# Altium schematic sheet Ports.SchDoc
size A4
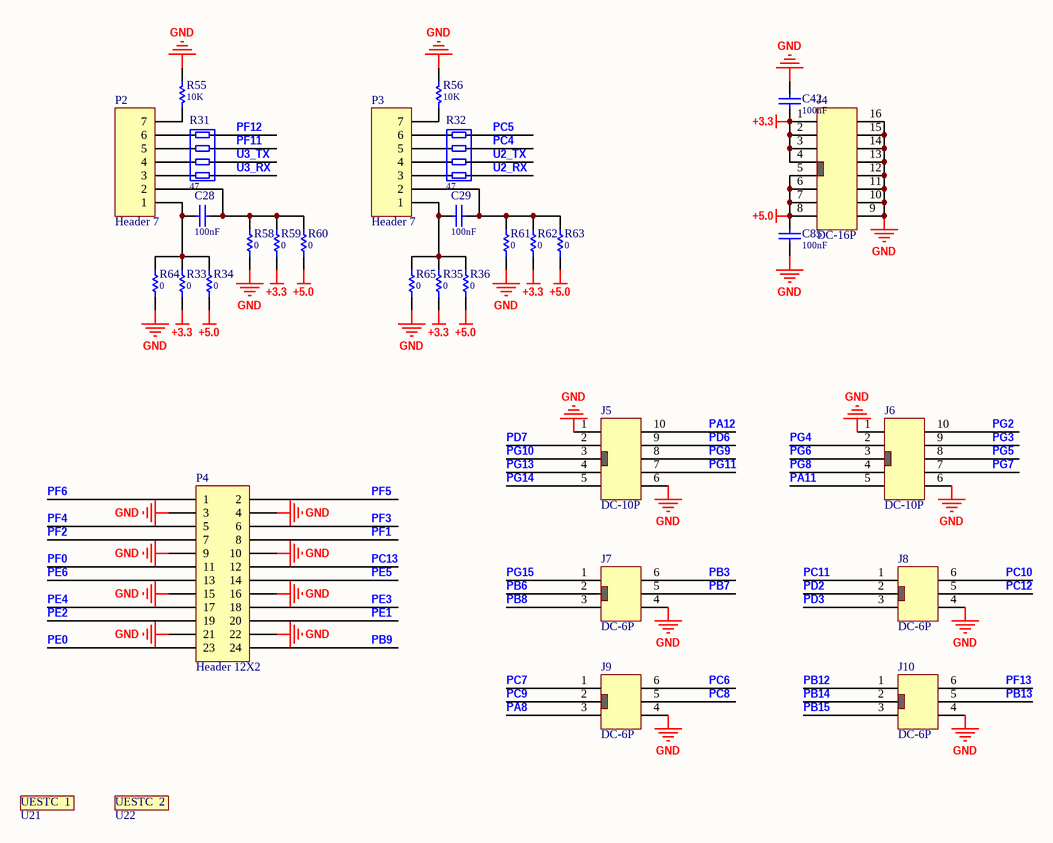
[diagram p0: Ports.SchDoc]

## Parts
C28  value 100nF  [C0603-L]  (hidden comment: Cap-S)
C29  value 100nF  [C0603-L]  (hidden comment: Cap-S)
C42  value 100nF  [C0603-L]  (hidden comment: Cap-S)
C85  value 100nF  [C0603-L]  (hidden comment: Cap-S)
J4  DC-16P  [DC-16P]
J5  DC-10P  [DC-10P]
J6  DC-10P  [DC-10P]
J7  DC-6P  [DC-6P]
J8  DC-6P  [DC-6P]
J9  DC-6P  [DC-6P]
J10  DC-6P  [DC-6P]
P2  Header 7  [HDR1X7]
P3  Header 7  [HDR1X7]
P4  Header 12X2  [HDR2X12]
R31  value 47  [R0603X4]  (hidden comment: R)
R32  value 47  [R0603X4]  (hidden comment: R)
R33  value 0  [R0603-L]  (hidden comment: R)
R34  value 0  [R0603-L]  (hidden comment: R)
R35  value 0  [R0603-L]  (hidden comment: R)
R36  value 0  [R0603-L]  (hidden comment: R)
R55  value 10K  [R0603-L]  (hidden comment: R)
R56  value 10K  [R0603-L]  (hidden comment: R)
R58  value 0  [R0603-L]  (hidden comment: R)
R59  value 0  [R0603-L]  (hidden comment: R)
R60  value 0  [R0603-L]  (hidden comment: R)
R61  value 0  [R0603-L]  (hidden comment: R)
R62  value 0  [R0603-L]  (hidden comment: R)
R63  value 0  [R0603-L]  (hidden comment: R)
R64  value 0  [R0603-L]  (hidden comment: R)
R65  value 0  [R0603-L]  (hidden comment: R)
U21  UESTC  1  [UESTC]  (value not drawn)
U22  UESTC  2  [UESTC  2]  (value not drawn)

## Nets
+3.3: C42.2 J4.1 J4.2 J4.3 J4.4 R33.1 R35.1 R59.1 R62.1
+5.0: C85.1 J4.5 J4.6 J4.7 J4.8 R34.1 R36.1 R60.1 R63.1
GND: C42.1 C85.2 J4.9 J4.10 J4.11 J4.12 J4.13 J4.14 J4.15 J4.16 J5.1 J5.6 J6.1 J6.6 J7.4 J8.4 J9.4 J10.4 P4.3 P4.4 P4.9 P4.10 P4.15 P4.16 P4.21 P4.22 R55.1 R56.1 R58.1 R61.1 R64.1 R65.1
PA8: J9.3
PA11: J6.5
PA12: J5.10
PB3: J7.6
PB6: J7.2
PB7: J7.5
PB8: J7.3
PB9: P4.24
PB12: J10.1
PB13: J10.5
PB14: J10.2
PB15: J10.3
PC4: R32.3
PC5: R32.4
PC6: J9.6
PC7: J9.1
PC8: J9.5
PC9: J9.2
PC10: J8.6
PC11: J8.1
PC12: J8.5
PC13: P4.12
PD2: J8.2
PD3: J8.3
PD6: J5.9
PD7: J5.2
PE0: P4.23
PE1: P4.20
PE2: P4.19
PE3: P4.18
PE4: P4.17
PE5: P4.14
PE6: P4.13
PF0: P4.11
PF1: P4.8
PF2: P4.7
PF3: P4.6
PF4: P4.5
PF5: P4.2
PF6: P4.1
PF11: R31.3
PF12: R31.4
PF13: J10.6
PG2: J6.10
PG3: J6.9
PG4: J6.2
PG5: J6.8
PG6: J6.3
PG7: J6.7
PG8: J6.4
PG9: J5.8
PG10: J5.3
PG11: J5.7
PG13: J5.4
PG14: J5.5
PG15: J7.1
U2_RX: R32.1
U2_TX: R32.2
U3_RX: R31.1
U3_TX: R31.2
NetC28_1: C28.1 P2.2 R58.2 R59.2 R60.2
NetC28_2: C28.2 P2.1 R33.2 R34.2 R64.2
NetC29_1: C29.1 P3.2 R61.2 R62.2 R63.2
NetC29_2: C29.2 P3.1 R35.2 R36.2 R65.2
NetP2_3: P2.3 R31.8
NetP2_4: P2.4 R31.7
NetP2_5: P2.5 R31.6
NetP2_6: P2.6 R31.5
NetP2_7: P2.7 R55.2
NetP3_3: P3.3 R32.8
NetP3_4: P3.4 R32.7
NetP3_5: P3.5 R32.6
NetP3_6: P3.6 R32.5
NetP3_7: P3.7 R56.2

## Library data of the parts
C28 C29 C42 C85 = Cap-S: 贴片瓷片电容
P2 P3 = Header 7: Header, 7-Pin; LatestRevisionDate: 17-Jul-2002; LatestRevisionNote: Re-released for DXP Platform.; Publisher: Altium Limited
P4 = Header 12X2: Header, 12-Pin, Dual row; LatestRevisionDate: 17-Jul-2002; LatestRevisionNote: Re-released for DXP Platform.; Publisher: Altium Limited
R31 R32 = Res-4R: 排阻 4
R33-R36 R55 R56 R58-R65 = Res: 贴片电阻